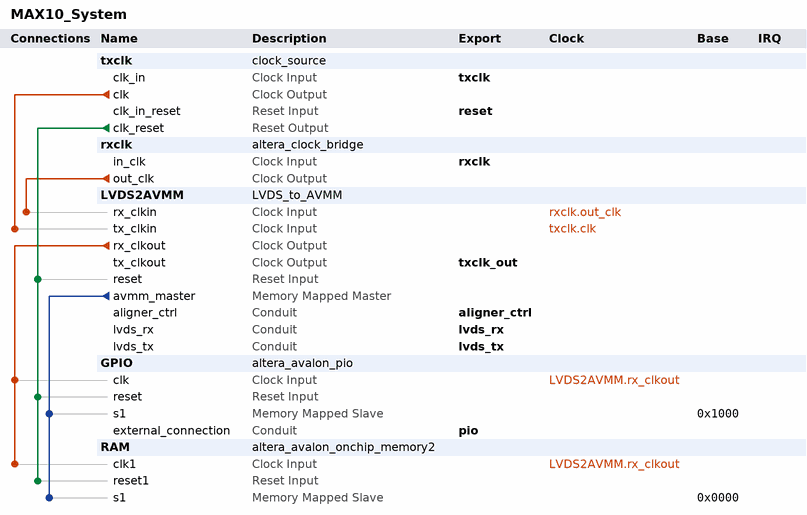
[diagram p0: system contents]
# Platform Designer (Qsys) system MAX10_System, Cyclone V 5CSXFC6D6F31C7
# Parameters at their usual value, and those the tool derives, are not listed.
package require -exact qsys 15.0
create_system MAX10_System
set_project_property DEVICE_FAMILY {Cyclone V}
set_project_property DEVICE 5CSXFC6D6F31C7

add_instance txclk clock_source 15.0
set_instance_parameter_value txclk clockFrequency 50000000

add_instance rxclk altera_clock_bridge 15.0
set_instance_parameter_value rxclk DERIVED_CLOCK_RATE 0
set_instance_parameter_value rxclk EXPLICIT_CLOCK_RATE 0

add_instance LVDS2AVMM LVDS_to_AVMM 1.0

add_instance GPIO altera_avalon_pio 15.0
set_instance_parameter_value GPIO direction Output
set_instance_parameter_value GPIO width 8

add_instance RAM altera_avalon_onchip_memory2 15.0
set_instance_parameter_value RAM dataWidth 8
set_instance_parameter_value RAM dualPort false
set_instance_parameter_value RAM initMemContent false
set_instance_parameter_value RAM initializationFileName onchip_mem.hex
set_instance_parameter_value RAM memorySize 4096

# connections
add_connection LVDS2AVMM.rx_clkout GPIO.clk clock
add_connection LVDS2AVMM.rx_clkout RAM.clk1 clock
add_connection rxclk.out_clk LVDS2AVMM.rx_clkin clock
add_connection txclk.clk LVDS2AVMM.tx_clkin clock
add_connection txclk.clk_reset GPIO.reset reset
add_connection txclk.clk_reset LVDS2AVMM.reset reset
add_connection txclk.clk_reset RAM.reset1 reset
add_connection LVDS2AVMM.avmm_master GPIO.s1 avalon
set_connection_parameter_value LVDS2AVMM.avmm_master/GPIO.s1 baseAddress 0x1000
add_connection LVDS2AVMM.avmm_master RAM.s1 avalon
set_connection_parameter_value LVDS2AVMM.avmm_master/RAM.s1 baseAddress 0x0000

# exported interfaces
add_interface aligner_ctrl conduit end
set_interface_property aligner_ctrl EXPORT_OF LVDS2AVMM.aligner_ctrl
add_interface lvds_rx conduit end
set_interface_property lvds_rx EXPORT_OF LVDS2AVMM.lvds_rx
add_interface lvds_tx conduit end
set_interface_property lvds_tx EXPORT_OF LVDS2AVMM.lvds_tx
add_interface pio conduit end
set_interface_property pio EXPORT_OF GPIO.external_connection
add_interface reset reset sink
set_interface_property reset EXPORT_OF txclk.clk_in_reset
add_interface rxclk clock sink
set_interface_property rxclk EXPORT_OF rxclk.in_clk
add_interface txclk clock sink
set_interface_property txclk EXPORT_OF txclk.clk_in
add_interface txclk_out clock source
set_interface_property txclk_out EXPORT_OF LVDS2AVMM.tx_clkout

set_interconnect_requirement {$system} qsys_mm.clockCrossingAdapter HANDSHAKE
set_interconnect_requirement {$system} qsys_mm.insertDefaultSlave FALSE
set_interconnect_requirement {$system} qsys_mm.maxAdditionalLatency 1

save_system MAX10_System.qsys
